# Altium project Driver_Display.PrjPcb
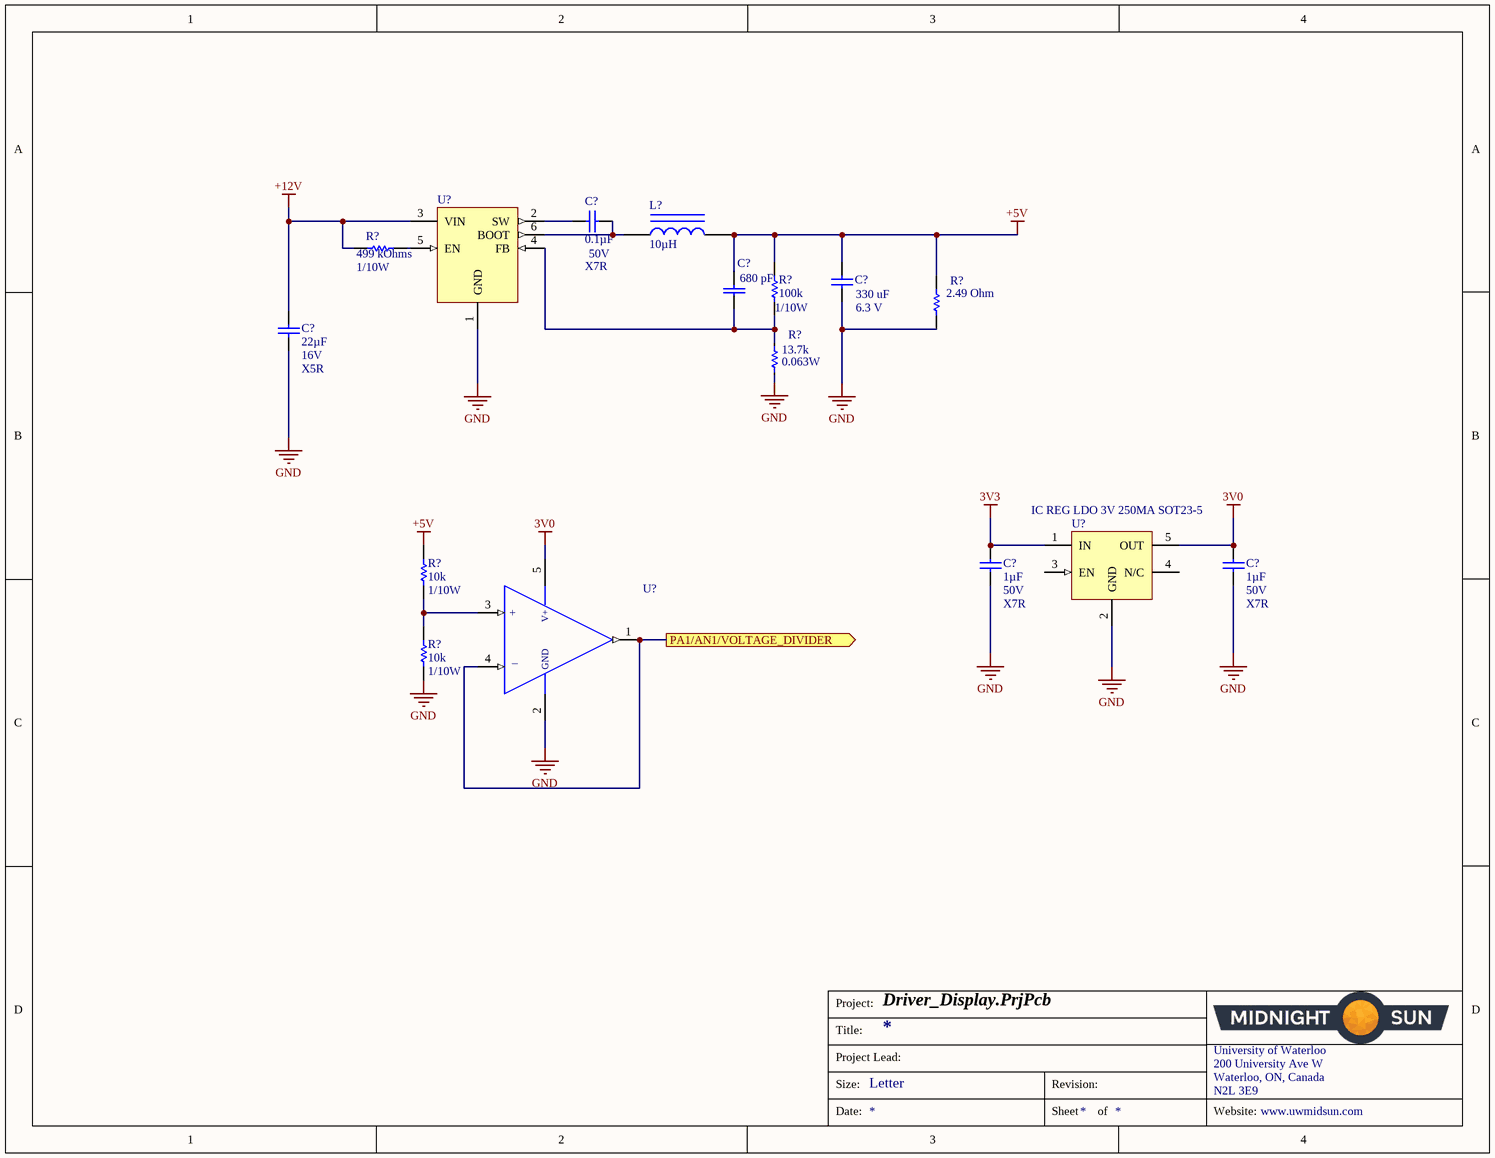
[diagram p0: Voltage Regulator.SchDoc]

5 sheets, 40 parts. Net scope: flat (ports and power ports of the same name join across sheets).
Board file: Driver_Display.PcbDoc
Sheets:
  Voltage Regulator.SchDoc
  RTC.SchDoc
  Ambient Light Sensor.SchDoc
  Controller_Board_Interface.SchDoc
  Connectors.SchDoc

## Sheet Voltage Regulator.SchDoc
size Letter; Organization: Midnight Sun Solar Rayce Car Team; Address1: University of Waterloo; Address2: 200 University Ave W; Address3: Waterloo, ON, Canada; Address4: N2L 3E9; Website: www.uwmidsun.com

### Parts
(Parts that share a designator on the sheet are numbered #1, #2 ... from top to bottom, then left to right.)
C?#1  Capacitance: 0.1µF  Voltage: 50V  Temperature Coefficient: X7R  [CAP, 0603]  (hidden comment: CAP CER 0.1UF 50V 10% X7R 0603)
C?#2  CAP CER 330UF 6.3V X5R 1210  (value not drawn)
C?#3  CAP CER 680PF 25V C0G 0201  [CAP, 0603]  (value not drawn)
C?#4  Capacitance: 22µF  Voltage: 16V  Temperature Coefficient: X5R  [CAP, 1210]  (hidden comment: CAP CER 22UF 16V ±20% X5R 1210)
C?#5  Capacitance: 1µF  Voltage: 50V  Temperature Coefficient: X7R  [CAP, 0603]  (hidden comment: CAP CER 1UF 50V 10% X7R 0603)
C?#6  Capacitance: 1µF  Voltage: 50V  Temperature Coefficient: X7R  [CAP, 0603]  (hidden comment: CAP CER 1UF 50V 10% X7R 0603)
L?  Inductance: 10µH  [1210]  (hidden comment: IND 10uH 0.9A 20% 1210)
R?#1  RES 499K OHM 1% 1/10W 0603  [RES, 0603]  (value not drawn)
R?#2  Resistance: 100k  Power: 1/10W  [RES, 0603]  (hidden comment: RES 100K OHM 5% 1/8W 0603_1)
R?#3  RES 2.49 OHM 1% 1/10W 0603  [RES, 0603]  (value not drawn)
R?#4  RES 13.7K OHM 1% 1/10W 0603  [RES, 0603]  (value not drawn)
R?#5  Resistance: 10k  Power: 1/10W  [RES, 0603]  (hidden comment: RES 10K OHM 1% 1/10W 0603)
R?#6  Resistance: 10k  Power: 1/10W  [RES, 0603]  (hidden comment: RES 10K OHM 1% 1/10W 0603)
U?#1  IC REG BUCK ADJ 2A SYNC 6SOT  [SOT23-6]  (value not drawn)
U?#2  IC REG LDO 3V 250MA SOT23-5  [SOT95P280X145-5N]
U?#3  IC OP AMP GEN PURPOSE RR 10MHZ SOT-23-5  [IC OP AMP GP RR 10MHZ SOT-23-5]  (value not drawn)

### Ports
PA1/AN1/VOLTAGE_DIVIDER (out)

### Nets
3V0: C?#6.1 U?#2.5(OUT) U?#3.5(VDD)
3V3: C?#5.1 U?#2.1(IN)
+5V: C?#2.1 C?#3.1 L?.2 R?#2.1 R?#3.1 R?#5.1
+12V: C?#4.1 R?#1.1 U?#1.3(VIN)
GND: C?#2.2 C?#4.2 C?#5.2 C?#6.2 R?#3.2 R?#4.?2 R?#6.2 U?#1.1(GND) U?#2.2(GND) U?#3.2(VSS)
PA1/AN1: U?#3.1(OUTPUT) U?#3.4(-IN) ; port PA1/AN1/VOLTAGE_DIVIDER
NetC?#1_1: C?#1.1 U?#1.2(SW)
NetC?#1_2: C?#1.2 L?.1 U?#1.6(BOOT)
NetC?#3_2: C?#3.2 R?#2.2 R?#4.?1 U?#1.4(FB)
NetR?#1_2: R?#1.2 U?#1.5(EN)
NetR?#5_2: R?#5.2 R?#6.1 U?#3.3(+IN)

Not connected (* = marked no-connect by the designer): U?#2 3(EN) 4(N/C)

### Notes on the sheet
- (near R?#1) 499 kOhms
- (near R?#1) 1/10W
- (near C?#2) 330 uF
- (near C?#2) 6.3 V
- Project:
- Title:
- Size:
- Project Lead:
- Letter
- Revision:
- University of Waterloo
- 200 University Ave W
- Waterloo, ON, Canada
- N2L 3E9
- Date:
- Sheet
- of
- Website:
- (in symbol CAP CER 680PF 25V C0G 0201) 680 pF
- (in symbol IC OP AMP GEN PURPOSE RR 10MHZ SOT-23-5) V+; +; GND; _
- (in symbol RES 2.49 OHM 1% 1/10W 0603) 2.49 Ohm
- (in symbol RES 13.7K OHM 1% 1/10W 0603) 13.7k; 0.063W

### Library data of the parts
C?#1 = CAP CER 0.1UF 50V 10% X7R 0603: 0.10µF ±10% 50V Ceramic Capacitor X7R 0603 (1608 Metric); Manufacturer 1: AVX Corporation; Manufacturer Part Number 1: 06035C104KAT2A; Supplier 1: Digi-Key; Supplier Part Number 1: 478-5052-1-ND; Packaging: Cut Tape (CT); Part Status: Active; Operating Temperature: -55°C ~ 125°C; Ratings: -; Mounting Type: Surface Mount, MLCC; Package / Case: 0603 (1608 Metric); Size / Dimension: 0.063" L x 0.032" W (1.60mm x 0.81mm); Height - Seated (Max): -; Thickness (Max): 0.035" (0.90mm); Lead Spacing: -; Lead Style: -; ComponentLink1URL: http://datasheets.avx.com/X7RDielectric.pdf; ComponentLink1Description: http://datasheets.avx.com/X7RDielectric.pdf; Tolerance: ±10%
C?#2 = CAP CER 330UF 6.3V X5R 1210: 330µF ±20% 6.3V Ceramic Capacitor X5R 1210 (3225 Metric); Manufacturer: Taiyo Yuden; Manufacturer Part Number: JMK325ABJ337MM-P; Supplier 1: Digi-Key; Stock 1: 1427; Pricing 1: 1=5.57, 10=4.492, 100=3.5039, 500=2.6055 (USD); Supplier Part Number 1: 587-5449-1-ND
C?#3 = CAP CER 680PF 25V C0G 0201: 680pF ±5% 25V Ceramic Capacitor C0G, NP0 0201 (0603 Metric); Manufacturer: Murata; Manufacturer Part Number: GRM0335C1E681JA01D; Supplier 1: Digi-Key; Stock 1: 66100; Pricing 1: 1=0.1, 10=0.017, 100=0.0078, 500=0.0056, 1000=0.0044, 2500=0.004, 5000=0.0037 (USD); Voltage Rating (DC): 25V; Dielectric: C0G; Tolerance: 5%; Capacitance: 680pF; Length: 600um; Width: 300um; Thickness: 300um; Supplier Part Number 1: 490-14330-1-ND
C?#4 = CAP CER 22UF 16V ±20% X5R 1210: 22µF ±20% 16V Ceramic Capacitor X5R 1210 (3225 Metric); Manufacturer 1: Murata Electronics North America; Manufacturer Part Number 1: GRM32ER61C226ME20L; Supplier 1: Digi-Key; Supplier Part Number 1: 490-1881-1-ND; Packaging: Cut Tape (CT); Part Status: Active; Operating Temperature: -55°C ~ 85°C; Ratings: -; Mounting Type: Surface Mount, MLCC; Package / Case: 1210 (3225 Metric); Size / Dimension: 0.126" L x 0.098" W (3.20mm x 2.50mm); Height - Seated (Max): -; Thickness (Max): 0.106" (2.70mm); Lead Spacing: -; Lead Style: -; ComponentLink1URL: http://www.murata.com/~/media/webrenewal/support/library/catalog/products/capacitor/mlcc/c02e.ashx; ComponentLink1Description: http://www.murata.com/~/media/webrenewal/support/library/catalog/products/capacitor/mlcc/c02e.ashx; Tolerance: ±20%
C?#5 C?#6 = CAP CER 1UF 50V 10% X7R 0603: 1µF ±10% 50V Ceramic Capacitor X7R 0603 (1608 Metric); Manufacturer 1: Taiyo Yuden; Manufacturer Part Number 1: UMK107AB7105KA-T; Supplier 1: Digi-Key; Supplier Part Number 1: 587-3247-1-ND; Packaging: Cut Tape (CT); Part Status: Active; Operating Temperature: -55°C ~ 125°C; Ratings: -; Mounting Type: Surface Mount, MLCC; Package / Case: 0603 (1608 Metric); Size / Dimension: 0.063" L x 0.031" W (1.60mm x 0.80mm); Height - Seated (Max): -; Thickness (Max): 0.037" (0.95mm); Lead Spacing: -; Lead Style: -; ComponentLink1URL: http://www.yuden.co.jp/productdata/catalog/en/mlcc_all_e.pdf; ComponentLink1Description: http://www.yuden.co.jp/productdata/catalog/en/mlcc_all_e.pdf; Tolerance: ±10%
L? = IND 10uH 0.9A 20% 1210: 10µH Shielded Wirewound Inductor 900mA 420 mOhm Max 1210 (3225 Metric); Manufacturer: Murata Electronics North America; Manufacturer Part Number: 1277AS-H-100M=P2; Current - Saturation: 1.25A; Supplier 1: Digi-Key; Supplier Part Number 1: 490-10589-1-ND; Type: Wirewound; Tolerance: ±20%; Current Rating: 0.9A; Shielding: Shielded; DC Resistance (DCR): 420 mOhm Max; Height - Seated (Max): 0.047" (1.20mm); ComponentLink1URL: http://www.toko.co.jp/products-murata/pdf/inductors/m_dfe322512c.pdf; ComponentLink1Description: datasheet
R?#1 = RES 499K OHM 1% 1/10W 0603: 499 kOhms ±1% 0.1W, 1/10W Chip Resistor 0603 (1608 Metric) Automotive AEC-Q200 Thick Film; Manufacturer: Stackpole Electronics; Manufacturer Part Number: RMCF0603FT499K; Resistance: 499kR; Power Rating: 100mW; Temperature Coefficient: 100ppm/°C; Supplier 1: Digi-Key; Stock 1: 5000; Mount: Surface Mount; Case/Package: 0603; Case Code (Metric): 1608; Case Code (Imperial): 0603; Contact Plating: Tin,Matte; Min Operating Temperature: -55°C; Max Operating Temperature: 155°C; Tolerance: 1%; Packaging: Tape and Reel; Composition: Thick Film; Number of Terminations: 2; Max Power Dissipation: 100mW; Length: 0.061inch; Height: 0.022inch; Width: 0.031inch; Radiation Hardening: No; Lead Free: Lead Free; ComponentLink1URL: https://www.seielect.com/Catalog/SEI-RMCF_RMCP.pdf; ComponentLink1Description: https://www.seielect.com/Catalog/SEI-RMCF_RMCP.pdf; ComponentLink2URL: http://components.arrow.com/part/dataview/40961429S7516275N1174; ComponentLink2Description: http://components.arrow.com/part/dataview/40961429S7516275N1174; ComponentLink3URL: http://www.seielect.com/Catalog/SEI-RMCF_RMCP.pdf; ComponentLink3Description: http://www.seielect.com/Catalog/SEI-RMCF_RMCP.pdf; Supplier Part Number 1: RMCF0603FT499K-ND
R?#2 = RES 100K OHM 5% 1/8W 0603_1: RES SMD 100K OHM 5% 1/10W 0603; Manufacturer 1: Yageo; Manufacturer Part Number 1: RC0603JR-07100KL; Temperature Coefficient: ±100ppm/°C; Supplier 1: Digi-Key; Supplier Part Number 1: 311-100KGRCT-ND; Packaging: Cut Tape (CT); Part Status: Active; Composition: Thick Film; Operating Temperature: -55°C ~ 155°C; Package / Case: 0603 (1608 Metric); Supplier Device Package: 0603; Size / Dimension: 0.063" L x 0.031" W (1.60mm x 0.80mm); Height - Seated (Max): 0.022" (0.55mm); Failure Rate: -; ComponentLink1URL: http://www.yageo.com/documents/recent/PYu-RC_Group_51_RoHS_L_7.pdf; ComponentLink1Description: http://www.yageo.com/documents/recent/PYu-RC_Group_51_RoHS_L_7.pdf; Tolerance: ±5%
R?#3 = RES 2.49 OHM 1% 1/10W 0603: 2.49 Ohms ±1% 0.1W, 1/10W Chip Resistor 0603 (1608 Metric) Moisture Resistant Thick Film; Manufacturer: Yageo; Manufacturer Part Number: RC0603FR-072R49L; Resistance: 2.49R; Temperature Coefficient: 200ppm/°C; Power Rating: 100mW; Voltage Rating: 50V; Working Voltage: 75V; Supplier 1: Digi-Key; Stock 1: 24600; Pricing 1: 1=0.1, 10=0.022, 100=0.0089, 1000=0.004, 2500=0.0035 (USD); Case/Package: 0603; Case Code (Metric): 1608; Case Code (Imperial): 0603; Contact Plating: Tin,Matte; Min Operating Temperature: -55°C; Max Operating Temperature: 155°C; Tolerance: 1%; Package Quantity: 1; Packaging: Tape and Reel; Composition: Thick Film; Number of Terminations: 2; Max Power Dissipation: 100mW; Termination: SMD/SMT; Voltage Rating (DC): 50V; Length: 0.063inch; Height: 0.022inch; Width: 0.031inch; Radiation Hardening: No; Lead Free: Lead Free; ComponentLink1URL: https://datasheet.ciiva.com/2456/pyu-r-int-thick-7-2456963.pdf; ComponentLink1Description: https://datasheet.ciiva.com/2456/pyu-r-int-thick-7-2456963.pdf; ComponentLink2URL: https://datasheet.ciiva.com/2456/pyu-r-int-thick-7-2456964.pdf; ComponentLink2Description: https://datasheet.ciiva.com/2456/pyu-r-int-thick-7-2456964.pdf; ComponentLink3URL: https://datasheet.ciiva.com/2456/pyu-r-int-thick-7-2456965.pdf; ComponentLink3Description: https://datasheet.ciiva.com/2456/pyu-r-int-thick-7-2456965.pdf; ComponentLink4URL: https://datasheet.ciiva.com/12575/rc0603-272842-12575883.pdf; ComponentLink4Description: https://datasheet.ciiva.com/12575/rc0603-272842-12575883.pdf; Supplier Part Number 1: 311-2.49HRCT-ND
R?#4 = RES 13.7K OHM 1% 1/10W 0603: 13.7 kOhms ±1% 0.1W, 1/10W Chip Resistor 0603 (1608 Metric) Automotive AEC-Q200 Thick Film; Supplier 1: Digi-Key
R?#5 R?#6 = RES 10K OHM 1% 1/10W 0603: RES SMD 10K OHM 1% 1/10W 0603; Manufacturer 1: Yageo; Manufacturer Part Number 1: RC0603FR-0710KL; Temperature Coefficient: ±100ppm/°C; Supplier 1: Digi-Key; Supplier Part Number 1: 311-10.0KHRCT-ND; Packaging: Cut Tape (CT); Part Status: Active; Composition: Thick Film; Operating Temperature: -55°C ~ 155°C; Package / Case: 0603 (1608 Metric); Supplier Device Package: 0603; Size / Dimension: 0.063" L x 0.031" W (1.60mm x 0.80mm); Height - Seated (Max): 0.022" (0.55mm); Failure Rate: -; ComponentLink1URL: http://www.yageo.com/documents/recent/PYu-RC_Group_51_RoHS_L_7.pdf; ComponentLink1Description: http://www.yageo.com/documents/recent/PYu-RC_Group_51_RoHS_L_7.pdf; Tolerance: ±1%
U?#1 = IC REG BUCK ADJ 2A SYNC 6SOT: Buck Switching Regulator IC Positive Adjustable 0.596V 1 Output 2A SOT-23-6 Thin, TSOT-23-6; Manufacturer: Texas Instruments; Manufacturer Part Number: TPS54202HDDCT; Min Input Voltage: 4.5V; Max Input Voltage: 28V; Number of Outputs: 1; Min Output Voltage: 600mV; Max Output Voltage: 26V; Switching Frequency: 500kHz; Quiescent Current: 40uA; Supplier 1: Digi-Key; Stock 1: 2574; Pricing 1: 1=2, 10=1.796, 100=1.4436 (USD); Case/Package: SOT-6; Number of Pins: 6; Min Operating Temperature: -40°C; Max Operating Temperature: 125°C; Output Current: 2A; Packaging: Cut Tape; Output Voltage: 26V; REACH SVHC: No SVHC; Lead Free: Lead Free; ComponentLink1URL: http://www.ti.com/lit/ds/symlink/tps54202h.pdf; ComponentLink1Description: http://www.ti.com/lit/ds/symlink/tps54202h.pdf; ComponentLink2URL: http://www.ti.com/general/docs/lit/getliterature.tsp?genericPartNumber=TPS54202H&amp;&amp;fileType=pdf; ComponentLink2Description: http://www.ti.com/general/docs/lit/getliterature.tsp?genericPartNumber=TPS54202H&amp;&amp;fileType=pdf; ComponentLink3URL: http://www.ti.com/general/docs/lit/getliterature.tsp?genericPartNumber=TPS54202H&&fileType=pdf; ComponentLink3Description: http://www.ti.com/general/docs/lit/getliterature.tsp?genericPartNumber=TPS54202H&&fileType=pdf; Supplier Part Number 1: 296-44497-1-ND
U?#2 = IC REG LDO 3V 250MA SOT23-5: Linear Voltage Regulator IC Positive Fixed 1 Output 3V 250mA SOT-23-5; Manufacturer: Texas Instruments; Manufacturer Part Number: LP5907QMFX-3.0Q1; Number of Outputs: 1; Min Input Voltage: 2.2V; Max Input Voltage: 5.5V; Dropout Voltage: 50mV; Quiescent Current: 425uA; Accuracy: 2%; Supplier 1: Digi-Key; Stock 1: 160397; Pricing 1: 1=0.65, 10=0.56, 100=0.4182, 500=0.3286, 1000=0.2539 (USD); Mount: Surface Mount; Min Operating Temperature: -40°C; Max Operating Temperature: 125°C; Max Output Current: 250mA; Output Voltage: 3V; Packaging: Tape and Reel; Output Current: 250mA; Number of Regulators: 1; Polarity: Positive; Radiation Hardening: No; Lead Free: Lead Free; ComponentLink1URL: https://datasheet.ciiva.com/48677/lp5907-q1-48677562.pdf; ComponentLink1Description: https://datasheet.ciiva.com/48677/lp5907-q1-48677562.pdf; Supplier Part Number 1: 296-40364-1-ND
U?#3 = IC OP AMP GEN PURPOSE RR 10MHZ SOT-23-5: General Purpose Amplifier 1 Circuit Rail-to-Rail SOT-23-5; Manufacturer 1: Texas Instruments; Manufacturer Part Number 1: TLV316QDBVRQ1; Description 1: IC OP AMP GP RR 10MHZ 5-SOT-23; Number of Circuits: 1; Slew Rate: 6 V/µs; Current - Supply: 400µA; Current - Output / Channel: 50mA; Voltage - Supply, Single/Dual (±): 1.8 V ~ 5.5 V, ±0.9 V ~ 2.75 V; Supplier 1: Digi-Key; Supplier Part Number 1: 296-45323-1-ND; RoHS: RoHS Compliant; Category: Integrated Circuits (ICs); Stock 1: 1747; Pricing 1: 1=1.33, 10=1.185, 100=0.9234, 500=0.76276, 1000=0.60218 (CAD); Packaging: Cut Tape (CT); Part Status: Active; Amplifier Type: General Purpose; Output Type: Rail-to-Rail; -3db Bandwidth: -; Operating Temperature: -40°C ~ 125°C; Mounting Type: Surface Mount; Package / Case: SC-74A, SOT-753; Supplier Device Package: SOT-23-5; ComponentLink1URL: http://www.ti.com/lit/ds/symlink/tlv316-q1.pdf; ComponentLink1Description: http://www.ti.com/lit/ds/symlink/tlv316-q1.pdf

## Sheet RTC.SchDoc
size Letter; Organization: Midnight Sun Solar Rayce Car Team; Address1: University of Waterloo; Address2: 200 University Ave W; Address3: Waterloo, ON, Canada; Address4: N2L 3E9; Website: www.uwmidsun.com
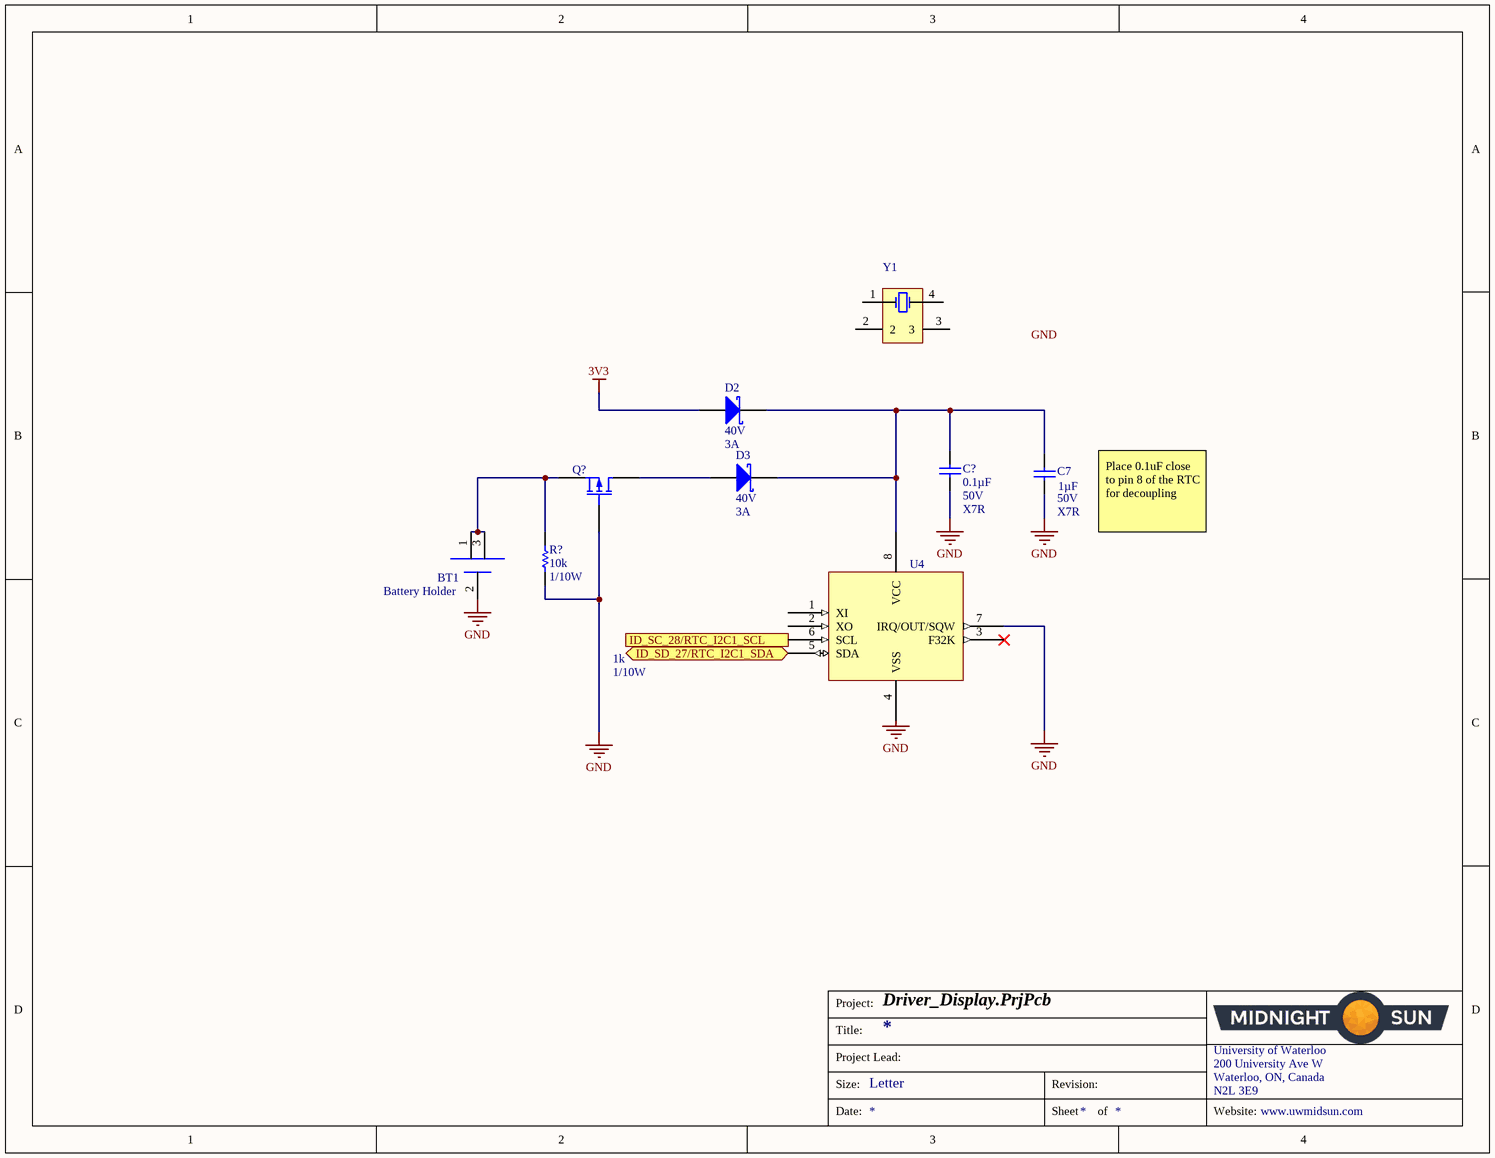
[diagram p1: RTC.SchDoc]

### Parts
(Parts that share a designator on the sheet are numbered #1, #2 ... from top to bottom, then left to right.)
BT1  HOLDER COIN CELL FOR CR1220 SMD  [HOLDER BUTTON BATTERY 3V]  (value not drawn)
C7  Capacitance: 1µF  Voltage: 50V  Temperature Coefficient: X7R  [CAP, 0603]  (hidden comment: CAP CER 1UF 50V 10% X7R 0603)
C?#7  Capacitance: 0.1µF  Voltage: 50V  Temperature Coefficient: X7R  [CAP, 0603]  (hidden comment: CAP CER 0.1UF 50V 10% X7R 0603)
D2  Voltage - DC Reverse (Vr) (Max): 40V  Current - Average Rectified (Io): 3A  [DO-214AA Diode]  (hidden comment: DIODE SCHOTTKY 40V 3A DO-214AA (SMB))
D3  Voltage - DC Reverse (Vr) (Max): 40V  Current - Average Rectified (Io): 3A  [DO-214AA Diode]  (hidden comment: DIODE SCHOTTKY 40V 3A DO-214AA (SMB))
Q?  MOSFET P-CH 16V 2.5A X2-DFN2015  [DFN86P197X40-3N]  (value not drawn)
R?#7  Resistance: 10k  Power: 1/10W  [RES, 0603]  (hidden comment: RES 10K OHM 1% 1/10W 0603)
U4  IC RTC CLK/CALENDAR I2C 8-SOIC  [SOIC8]  (value not drawn)
Y1  CRYSTAL 32.7680KHZ 12.5PF SMD  [4-SOJ]  (value not drawn)

### Ports
ID_SC_28/RTC_I2C1_SCL (in), ID_SD_27/RTC_I2C1_SDA (bidir)

### Nets
3V3: D2.1(A)
GND: BT1.2(negative) C7.2 C?#7.2 Q?.1(G) R?#7.2 U4.7(IRQ/OUT/SQW)
NetBT1_1: BT1.1(positive_1) BT1.3(positive_2) Q?.2(S) R?#7.1
NetC7_1: C7.1 C?#7.1 D2.2(K) D3.2(K) U4.8(VCC)
NetD3_1: D3.1(A) Q?.3(D)
NetU4_5: U4.5(SDA) ; port ID_SD_27/RTC_I2C1_SDA
NetU4_6: U4.6(SCL) ; port ID_SC_28/RTC_I2C1_SCL

Not connected (* = marked no-connect by the designer): U4 1(XI) 2(XO) 3(F32K)* 4(VSS); Y1 1 2 3 4

### Notes on the sheet
- Place 0.1uF close to pin 8 of the RTC for decoupling
- (near BT1) Battery Holder
- 1k
- 1/10W
- Project:
- Title:
- Size:
- Project Lead:
- Letter
- Revision:
- University of Waterloo
- 200 University Ave W
- Waterloo, ON, Canada
- N2L 3E9
- Date:
- Sheet
- of
- Website:
- Labels drawn without touching a wire or pin: GND

### Library data of the parts
BT1 = HOLDER COIN CELL FOR CR1220 SMD: Coin cell holder; Manufacturer: Memory Protection Devices; Manufacturer Part Number: BC501SM-TR; Number of Cells: 1; Body Material: Bronze; Supplier 1: Digi-Key; Stock 1: 21261; Pricing 1: 1=1.26, 10=1.166, 100=1.1029 (USD); Mount: Surface Mount,PCB; Case/Package: SMD/SMT; Min Operating Temperature: -40°C; Max Operating Temperature: 85°C; Package Quantity: 500; Termination: SMD/SMT; ComponentLink1URL: https://datasheet.ciiva.com/4/bc501sm-tr-datasheet-4384.pdf; ComponentLink1Description: https://datasheet.ciiva.com/4/bc501sm-tr-datasheet-4384.pdf; Supplier 2: Digi-Key; Stock 2: 19094; Pricing 2: 1=0.58, 10=0.545, 50=0.4356, 100=0.4175, 250=0.3812, 500=0.363, 1000=0.305, 2500=0.2723, 5000=0.2632 (USD); Contact Material: Bronze,Nickel; Material: Bronze; Contact Plating: Nickel; Packaging: Bulk; Number of Batteries: 1; Diameter: 12mm; Height: 3.17mm; REACH SVHC: No SVHC; Lead Free: Lead Free; ComponentLink2URL: https://datasheet.ciiva.com/3/3000-3953.pdf; ComponentLink2Description: https://datasheet.ciiva.com/3/3000-3953.pdf; ComponentLink3URL: https://datasheet.ciiva.com/11714/0900766b8002ef78-11714721.pdf; ComponentLink3Description: https://datasheet.ciiva.com/11714/0900766b8002ef78-11714721.pdf; ComponentLink4URL: https://datasheet.ciiva.com/20221/18-3570e-20221596.pdf; ComponentLink4Description: https://datasheet.ciiva.com/20221/18-3570e-20221596.pdf; ComponentLink5URL: https://datasheet.ciiva.com/1391/1718262-1391630.pdf; ComponentLink5Description: https://datasheet.ciiva.com/1391/1718262-1391630.pdf; Supplier Part Number 2: 36-3000-ND
C7 = CAP CER 1UF 50V 10% X7R 0603: as C?#5 on sheet Voltage Regulator; Supplier 1: Digi-Key; Supplier Part Number 1: 587-3247-1-ND; Packaging: Cut Tape (CT); Part Status: Active; Operating Temperature: -55°C ~ 125°C; Ratings: -; Mounting Type: Surface Mount, MLCC; Package / Case: 0603 (1608 Metric); Size / Dimension: 0.063" L x 0.031" W (1.60mm x 0.80mm); Height - Seated (Max): -; Thickness (Max): 0.037" (0.95mm); Lead Spacing: -; Lead Style: -; ComponentLink1URL: http://www.yuden.co.jp/productdata/catalog/en/mlcc_all_e.pdf; ComponentLink1Description: http://www.yuden.co.jp/productdata/catalog/en/mlcc_all_e.pdf; Tolerance: ±10%
C?#7 = CAP CER 0.1UF 50V 10% X7R 0603: as C?#1 on sheet Voltage Regulator; Supplier 1: Digi-Key; Supplier Part Number 1: 478-5052-1-ND; Packaging: Cut Tape (CT); Part Status: Active; Operating Temperature: -55°C ~ 125°C; Ratings: -; Mounting Type: Surface Mount, MLCC; Package / Case: 0603 (1608 Metric); Size / Dimension: 0.063" L x 0.032" W (1.60mm x 0.81mm); Height - Seated (Max): -; Thickness (Max): 0.035" (0.90mm); Lead Spacing: -; Lead Style: -; ComponentLink1URL: http://datasheets.avx.com/X7RDielectric.pdf; ComponentLink1Description: http://datasheets.avx.com/X7RDielectric.pdf; Tolerance: ±10%
D2 D3 = DIODE SCHOTTKY 40V 3A DO-214AA (SMB): Diode Schottky 40V 3A Surface Mount DO-214AA (SMB); Manufacturer 1: Comchip Technology; Manufacturer Part Number 1: CDBB340-HF; Voltage - Forward (Vf) (Max) @ If: 500mV @ 3A; Speed: Fast Recovery =< 500ns, > 200mA (Io); Current - Reverse Leakage @ Vr: 500µA @ 40V; Capacitance @ Vr, F: 250pF @ 4V, 1MHz; Supplier 1: Digi-Key; Supplier Part Number 1: 641-1722-1-ND; Packaging: Cut Tape (CT); Part Status: Active; Diode Type: Schottky; Mounting Type: Surface Mount; Package / Case: DO-214AA, SMB; Supplier Device Package: DO-214AA (SMB); Operating Temperature - Junction: -40°C ~ 70°C; ComponentLink1URL: http://www.comchiptech.com/cms/UserFiles/CDBB340-HF%20Thru849517.%20CDBB3100-HF%20RevE.pdf; ComponentLink1Description: http://www.comchiptech.com/cms/UserFiles/CDBB340-HF%20Thru849517.%20CDBB3100-HF%20RevE.pdf
Q? = MOSFET P-CH 16V 2.5A X2-DFN2015: P-Channel 16V 2.5A (Ta) 650mW (Ta) Surface Mount X2-DFN2015-3; Manufacturer 1: Diodes Incorporated; Manufacturer Part Number 1: DMG3415UFY4Q-7; Drive Voltage (Max Rds On,  Min Rds On): 1.8V, 4.5V; Vgs(th) (Max) @ Id: 1V @ 250µA; Gate Charge (Qg) (Max) @ Vgs: 10nC @ 4.5V; Input Capacitance (Ciss) (Max) @ Vds: 282pF @ 10V; Vgs (Max): ±8V; Rds On (Max) @ Id, Vgs: 39 mOhm @ 4A, 4.5V; Supplier 1: Digi-Key; Supplier Part Number 1: DMG3415UFY4Q-7DICT-ND; Packaging: Cut Tape (CT); Part Status: Active; FET Type: P-Channel; Technology: MOSFET (Metal Oxide); Drain to Source Voltage (Vdss): 16V; Current - Continuous Drain (Id) @ 25°C: 2.5A (Ta); FET Feature: -; Power Dissipation (Max): 650mW (Ta); Operating Temperature: -55°C ~ 150°C (TJ); Mounting Type: Surface Mount; Supplier Device Package: X2-DFN2015-3; Package / Case: 3-XFDFN; ComponentLink1URL: https://www.diodes.com/assets/Datasheets/DMG3415UFY4Q.pdf; ComponentLink1Description: https://www.diodes.com/assets/Datasheets/DMG3415UFY4Q.pdf
R?#7 = RES 10K OHM 1% 1/10W 0603: as R?#5 on sheet Voltage Regulator; Supplier 1: Digi-Key; Supplier Part Number 1: 311-10.0KHRCT-ND; Packaging: Cut Tape (CT); Part Status: Active; Composition: Thick Film; Operating Temperature: -55°C ~ 155°C; Package / Case: 0603 (1608 Metric); Supplier Device Package: 0603; Size / Dimension: 0.063" L x 0.031" W (1.60mm x 0.80mm); Height - Seated (Max): 0.022" (0.55mm); Failure Rate: -; ComponentLink1URL: http://www.yageo.com/documents/recent/PYu-RC_Group_51_RoHS_L_7.pdf; ComponentLink1Description: http://www.yageo.com/documents/recent/PYu-RC_Group_51_RoHS_L_7.pdf; Tolerance: ±1%
U4 = IC RTC CLK/CALENDAR I2C 8-SOIC: Real Time Clock (RTC) IC Clock/Calendar I²C, 2-Wire Serial 8-SOIC (0.154", 3.90mm Width); Manufacturer: STMicroelectronics; Manufacturer Part Number: M41T80M6F; Non-volatile Memory Size: 20B; Max Supply Voltage: 5.5V; Min Supply Voltage: 2V; Interface: I2C,Serial,2-Wire; Time Format: HH:MM:SS:hh (24 hr); Date Format: YY-MM-DD-dd; Supplier 1: Digi-Key; Stock 1: 1177; Pricing 1: 1=2.24, 10=2.012, 100=1.6169, 500=1.3284, 1000=1.1007 (USD); Mount: Surface Mount; Case/Package: SOIC; Number of Pins: 8; Weight: 0.019048oz; Contact Plating: Tin,Matte; Min Operating Temperature: -40°C; Max Operating Temperature: 85°C; Packaging: Tape and Reel; Package Quantity: 2500; Logic Function: Clock; Memory Size: 20B; RAM Size: 20B; Radiation Hardening: No; Lead Free: Lead Free; ComponentLink1URL: https://datasheet.ciiva.com/4772/cd00003119-4772151.pdf; ComponentLink1Description: https://datasheet.ciiva.com/4772/cd00003119-4772151.pdf; ComponentLink2URL: https://datasheet.ciiva.com/8145/cd00003119-8145447.pdf; ComponentLink2Description: https://datasheet.ciiva.com/8145/cd00003119-8145447.pdf; ComponentLink3URL: https://datasheet.ciiva.com/26795/m41t80m6f-26795475.pdf; ComponentLink3Description: https://datasheet.ciiva.com/26795/m41t80m6f-26795475.pdf; ComponentLink4URL: https://datasheet.ciiva.com/41459/001185350-da-01-en-ic-rtc-serial-w-ala-m41t80m6f-soic-8-stm-41459822.pdf; ComponentLink4Description: https://datasheet.ciiva.com/41459/001185350-da-01-en-ic-rtc-serial-w-ala-m41t80m6f-soic-8-stm-41459822.pdf; Supplier Part Number 1: 497-4708-1-ND
Y1 = CRYSTAL 32.7680KHZ 12.5PF SMD: 32.768kHz ±20ppm Crystal 12.5pF 50 kOhms 4-SOJ, 5.50mm pitch; Manufacturer: ECS International; Manufacturer Part Number: ECS-.327-12.5-17X-TR; ESR (Equivalent Series Resistance): 50kR; Supplier 1: Digi-Key; Stock 1: 67622; Pricing 1: 1=0.56, 10=0.468, 50=0.4208, 100=0.374, 500=0.3553, 1000=0.2992 (USD); Mount: Surface Mount; Min Operating Temperature: -40°C; Max Operating Temperature: 85°C; Package Quantity: 1; Frequency: 32.768kHz; Frequency Tolerance: 20ppm; Load Capacitance: 12.5pF; Packaging: Tape and Reel; Tolerance: 20ppm; Termination: SMD/SMT; Length: 0.315inch; Height: 0.098inch; Width: 0.15inch; Lead Free: Lead Free; ComponentLink1URL: https://datasheet.ciiva.com/852/ecx-306x-852775.pdf; ComponentLink1Description: https://datasheet.ciiva.com/852/ecx-306x-852775.pdf; ComponentLink2URL: https://datasheet.ciiva.com/852/ecx-306x-852776.pdf; ComponentLink2Description: https://datasheet.ciiva.com/852/ecx-306x-852776.pdf; ComponentLink3URL: https://datasheet.ciiva.com/852/ecx-306x-852777.pdf; ComponentLink3Description: https://datasheet.ciiva.com/852/ecx-306x-852777.pdf; Supplier Part Number 1: XC1195CT-ND

## Sheet Ambient Light Sensor.SchDoc
size Letter; Organization: Midnight Sun Solar Rayce Car Team; Address1: University of Waterloo; Address2: 200 University Ave W; Address3: Waterloo, ON, Canada; Address4: N2L 3E9; Website: www.uwmidsun.com
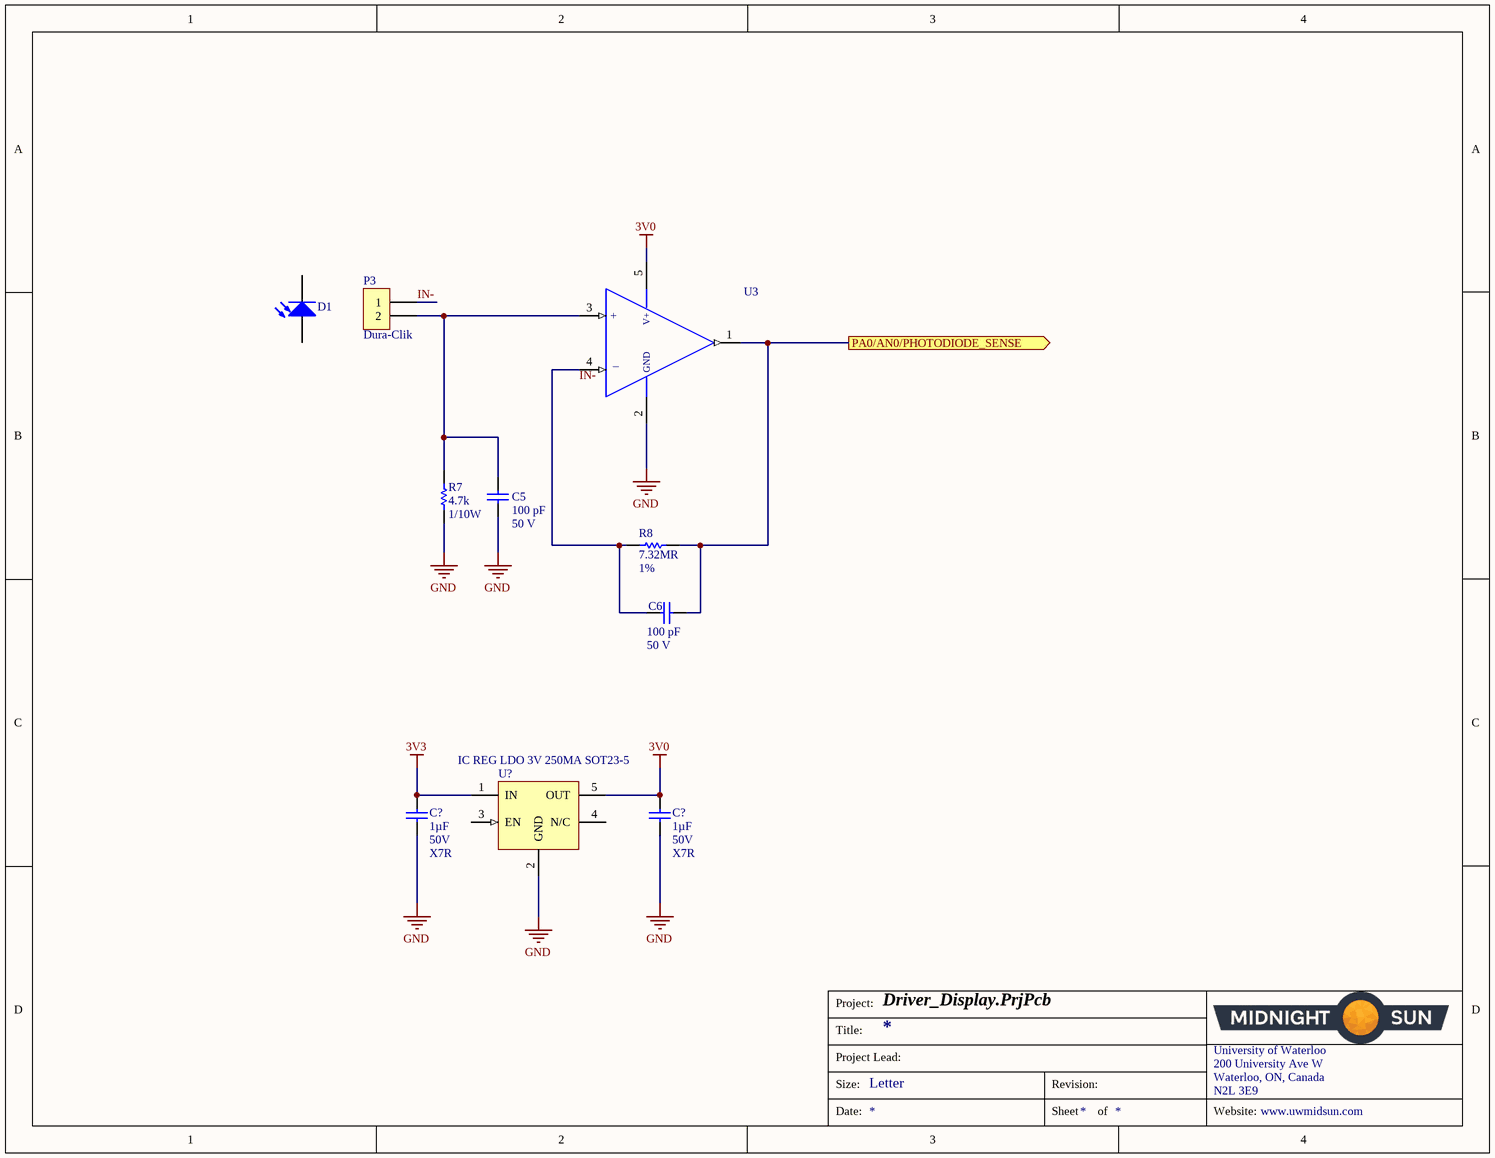
[diagram p2: Ambient Light Sensor.SchDoc]

### Parts
(Parts that share a designator on the sheet are numbered #1, #2 ... from top to bottom, then left to right.)
C5  CAP CER 100PF 50V C0G/NP0 0603  [CAP, 0603]  (value not drawn)
C6  CAP CER 100PF 50V C0G/NP0 0603  [CAP, 0603]  (value not drawn)
C?#8  Capacitance: 1µF  Voltage: 50V  Temperature Coefficient: X7R  [CAP, 0603]  (hidden comment: CAP CER 1UF 50V 10% X7R 0603)
C?#9  Capacitance: 1µF  Voltage: 50V  Temperature Coefficient: X7R  [CAP, 0603]  (hidden comment: CAP CER 1UF 50V 10% X7R 0603)
D1  DIODE 880NM W/FLTR THRUHOLE  (value not drawn)  (graphical)
P3  Dura-Clik  [CONN, 2POS Dura-Click Vertical]
R7  Resistance (Ohms): 4.7k  Power (Watts): 1/10W  [RES, 0603]  (hidden comment: RES 4.7K OHM 1% 1/10W 0603)
R8  Resistance: 7.32MR  Tolerance: 1%  [RES, 0603]  (hidden comment: RES 7.32M OHM 1% 1/10W 0603)
U3  IC OP AMP GEN PURPOSE RR 10MHZ SOT-23-5  [IC OP AMP GP RR 10MHZ SOT-23-5]  (value not drawn)
U?#4  IC REG LDO 3V 250MA SOT23-5  [SOT95P280X145-5N]

### Ports
PA0/AN0/PHOTODIODE_SENSE (out)

### Nets
3V0: C?#9.1 U3.5(VDD) U?#4.5(OUT)
3V3: C?#8.1 U?#4.1(IN)
GND: C5.2 C?#8.2 C?#9.2 R7.1 U3.2(VSS) U?#4.2(GND)
IN-: P3.1
PA0/AN0: C6.2 R8.1 U3.1(OUTPUT) ; port PA0/AN0/PHOTODIODE_SENSE
NetC5_1: C5.1 P3.2 R7.2 U3.3(+IN)
NetC6_1: C6.1 R8.1 U3.4(-IN)

Not connected (* = marked no-connect by the designer): D1 1(A) 2(K); U?#4 3(EN) 4(N/C)

### Notes on the sheet
- (near C5) 100 pF
- (near C5) 50 V
- (near C6) 100 pF
- (near C6) 50 V
- Project:
- Title:
- Size:
- Project Lead:
- Letter
- Revision:
- University of Waterloo
- 200 University Ave W
- Waterloo, ON, Canada
- N2L 3E9
- Date:
- Sheet
- of
- Website:
- Labels drawn without touching a wire or pin: IN-
- (in symbol IC OP AMP GEN PURPOSE RR 10MHZ SOT-23-5) V+; +; GND; _

### Library data of the parts
C5 C6 = CAP CER 100PF 50V C0G/NP0 0603: 100pF ±1% 50V Ceramic Capacitor C0G, NP0 0603 (1608 Metric); Manufacturer: Kyocera AVX; Manufacturer Part Number: 06035A101FAT2A; Supplier 1: Digi-Key; Stock 1: 176069; Pricing 1: 1=0.24, 10=0.161, 100=0.0814, 500=0.0557, 1000=0.0493 (USD); Mount: Surface Mount; Case/Package: 0603; Case Code (Imperial): 0603; Case Code (Metric): 1608; Min Operating Temperature: -55°C; Max Operating Temperature: 125°C; Capacitance: 100pF; Tolerance: 1%; Packaging: Tape and Reel; Voltage Rating: 50V; Package Quantity: 1; Voltage Rating (DC): 50V; Dielectric: C0G; Termination: SMD/SMT; Voltage: 50V; Length: 1.6mm; Height: 0.86mm; Width: 0.81mm; Thickness: 0.035inch; Depth: 0.81mm; Radiation Hardening: No; REACH SVHC: No SVHC; Lead Free: Lead Free; ComponentLink1URL: https://datasheet.ciiva.com/22682/1796416-22682854.pdf; ComponentLink1Description: https://datasheet.ciiva.com/22682/1796416-22682854.pdf; ComponentLink2URL: https://datasheet.ciiva.com/150/ccog-150746.pdf; ComponentLink2Description: https://datasheet.ciiva.com/150/ccog-150746.pdf; ComponentLink3URL: https://datasheet.ciiva.com/150/ccog-150747.pdf; ComponentLink3Description: https://datasheet.ciiva.com/150/ccog-150747.pdf; ComponentLink4URL: https://datasheet.ciiva.com/150/ccog-150748.pdf; ComponentLink4Description: https://datasheet.ciiva.com/150/ccog-150748.pdf; ComponentLink5URL: https://datasheet.ciiva.com/28585/1796416-28585980.pdf; ComponentLink5Description: https://datasheet.ciiva.com/28585/1796416-28585980.pdf; ComponentLink6URL: https://datasheet.ciiva.com/16300/ccog-16300413.pdf; ComponentLink6Description: https://datasheet.ciiva.com/16300/ccog-16300413.pdf; ComponentLink7URL: https://datasheet.ciiva.com/17492/ccog-17492189.pdf; ComponentLink7Description: https://datasheet.ciiva.com/17492/ccog-17492189.pdf; Supplier Part Number 1: 478-6202-1-ND
C?#8 C?#9 = CAP CER 1UF 50V 10% X7R 0603: as C?#5 on sheet Voltage Regulator; Supplier 1: Digi-Key; Supplier Part Number 1: 587-3247-1-ND; Packaging: Cut Tape (CT); Part Status: Active; Operating Temperature: -55°C ~ 125°C; Ratings: -; Mounting Type: Surface Mount, MLCC; Package / Case: 0603 (1608 Metric); Size / Dimension: 0.063" L x 0.031" W (1.60mm x 0.80mm); Height - Seated (Max): -; Thickness (Max): 0.037" (0.95mm); Lead Spacing: -; Lead Style: -; ComponentLink1URL: http://www.yuden.co.jp/productdata/catalog/en/mlcc_all_e.pdf; ComponentLink1Description: http://www.yuden.co.jp/productdata/catalog/en/mlcc_all_e.pdf; Tolerance: ±10%
D1 = DIODE 880NM W/FLTR THRUHOLE: Photodiode 880nm 20ns 120° 2-DIP (0.213", 5.40mm); Manufacturer: Osram Opto; Manufacturer Part Number: BPW34FA; Forward Current: 100mA; Reverse Breakdown Voltage: 32V; Forward Voltage: 1.3V; Max Power Dissipation: 150mW; Polarity: Reverse; Dark Current: 2nA; Diode Type: PIN; Max Reverse Voltage (DC): 16V; Supplier 1: Digi-Key; Stock 1: 7675; Pricing 1: 1=1.12, 10=0.867, 25=0.7188, 100=0.6195, 250=0.5452, 500=0.4708, 1000=0.3717, 2500=0.3469, 5000=0.3345 (USD); Mount: Through Hole,PCB; Case/Package: DIP; Number of Pins: 2; Contact Plating: Tin,Matte; Min Operating Temperature: -40°C; Max Operating Temperature: 100°C; Package Quantity: 1000; Wavelength: 880nm; Viewing Angle: 120°; Rise Time: 20ns; Packaging: Bulk; Fall Time: 20ns; Response Time: 20ns; Power Dissipation: 150mW; Reverse Voltage (DC): 16V; Length: 4.5mm; Height: 2.2mm; Width: 4mm; Radiation Hardening: No; REACH SVHC: No SVHC; ComponentLink1URL: https://datasheet.ciiva.com/1248/1672033-1248688.pdf; ComponentLink1Description: https://datasheet.ciiva.com/1248/1672033-1248688.pdf; ComponentLink2URL: https://datasheet.ciiva.com/4697/pw34fa-pb-free-2007-03-30-21826-4697664.pdf; ComponentLink2Description: https://datasheet.ciiva.com/4697/pw34fa-pb-free-2007-03-30-21826-4697664.pdf; ComponentLink3URL: https://datasheet.ciiva.com/1248/23915-1248689.pdf; ComponentLink3Description: https://datasheet.ciiva.com/1248/23915-1248689.pdf; ComponentLink4URL: https://datasheet.ciiva.com/4269/bpw34faleadpbfreeproduct-rohscompliant-4269826.pdf; ComponentLink4Description: https://datasheet.ciiva.com/4269/bpw34faleadpbfreeproduct-rohscompliant-4269826.pdf; ComponentLink5URL: https://datasheet.ciiva.com/15223/getdatasheetpartid-103433-15223260.pdf; ComponentLink5Description: https://datasheet.ciiva.com/15223/getdatasheetpartid-103433-15223260.pdf; ComponentLink6URL: https://datasheet.ciiva.com/2819/00100764-0-2819838.pdf; ComponentLink6Description: https://datasheet.ciiva.com/2819/00100764-0-2819838.pdf; Supplier Part Number 1: 475-1072-ND
P3 = CONN 2POS DURA-CLIK 0.079" VERT: 2 Positions Header, Shrouded Connector 0.079" (2.00mm) Surface Mount, Vertical Tin; Manufacturer: Molex, LLC; Manufacturer Part Number: 5600200220; Style: Board to Cable/Wire; Shrouding: Shrouded - 4 Wall; Number of Positions: 2; Number of Positions Loaded: All; Mated Stacking Heights: 9.3mm; Supplier 1: Digi-Key; RoHS: RoHS Compliant; Category: Connectors, Interconnects; Stock 1: 11912; Pricing 1: 1=1.16, 10=1.012, 25=0.952, 50=0.9122, 100=0.8727, 250=0.79336 (CAD); Packaging: Cut Tape (CT); Part Status: Active; Connector Type: Header; Contact Type: Male Pin; Pitch - Mating: 0.079" (2.00mm); Number of Rows: 1; Row Spacing - Mating: -; Mounting Type: Surface Mount; Termination: Solder; Fastening Type: Latch Lock; Contact Length - Mating: -; Contact Length - Post: -; Overall Contact Length: -; Insulation Height: 0.315" (8.00mm); Contact Shape: Square; Contact Finish - Mating: Tin; Contact Finish Thickness - Mating: -; Contact Finish - Post: Tin; Contact Material: Copper Alloy; Insulation Material: Polyamide (PA), Nylon; Features: Solder Retention; Operating Temperature: -; Ingress Protection: -; Material Flammability Rating: -; Insulation Color: Natural; Current Rating: -; Voltage Rating: -; Contact Finish Thickness - Post: -; Applications: Automotive, Industrial; ComponentLink1URL: http://www.molex.com/pdm_docs/sd/5600200220_sd.pdf; ComponentLink1Description: http://www.molex.com/pdm_docs/sd/5600200220_sd.pdf; Supplier Part Number 1: WM10862CT-ND
R7 = RES 4.7K OHM 1% 1/10W 0603: 4.7k Ohm ±1% 0.1W, 1/10W Chip Resistor 0603 (1608 Metric) Moisture Resistant Thick Film; Manufacturer 1: Yageo; Manufacturer Part Number 1: RC0603FR-074K7L; Description 1: RES SMD 4.7K OHM 1% 1/10W 0603; Temperature Coefficient: ±100ppm/°C; Supplier 1: Digi-Key; Supplier Part Number 1: 311-4.70KHRCT-ND; RoHS: RoHS Compliant; Category: Resistors; Stock 1: 3487566; Pricing 1: 1=0.16, 10=0.022, 100=0.0089, 1000=0.00402, 2500=0.00349 (CAD); Packaging: Cut Tape (CT); Part Status: Active; Composition: Thick Film; Features: Moisture Resistant; Operating Temperature: -55°C ~ 155°C; Package / Case: 0603 (1608 Metric); Supplier Device Package: 0603; Size / Dimension: 0.063" L x 0.031" W (1.60mm x 0.80mm); Height - Seated (Max): 0.022" (0.55mm); Failure Rate: -; ComponentLink1URL: http://www.yageo.com/documents/recent/PYu-RC_Group_51_RoHS_L_7.pdf; ComponentLink1Description: http://www.yageo.com/documents/recent/PYu-RC_Group_51_RoHS_L_7.pdf; Tolerance: ±1%
R8 = RES 7.32M OHM 1% 1/10W 0603: 7.32 MOhms ±1% 0.1W, 1/10W Chip Resistor 0603 (1608 Metric) Automotive AEC-Q200 Thick Film; Manufacturer: Stackpole Electronics; Manufacturer Part Number: RMCF0603FT7M32; Temperature Coefficient: 200ppm/°C; Supplier 1: Digi-Key; Stock 1: 4815; Pricing 1: 1=0.1, 10=0.016, 100=0.0064, 1000=0.0029, 2500=0.0025 (USD); Mount: Surface Mount; Case/Package: 0603; Contact Plating: Tin,Matte; Min Operating Temperature: -55°C; Max Operating Temperature: 155°C; Packaging: Tape and Reel; Composition: Thick Film; Radiation Hardening: No; ComponentLink1URL: https://www.seielect.com/catalog/SEI-RMCF_RMCP.pdf; ComponentLink1Description: https://www.seielect.com/catalog/SEI-RMCF_RMCP.pdf; Supplier Part Number 1: RMCF0603FT7M32CT-ND
U3 = IC OP AMP GEN PURPOSE RR 10MHZ SOT-23-5: as U?#3 on sheet Voltage Regulator; Supplier 1: Digi-Key; Supplier Part Number 1: 296-45323-1-ND; RoHS: RoHS Compliant; Category: Integrated Circuits (ICs); Stock 1: 1747; Pricing 1: 1=1.33, 10=1.185, 100=0.9234, 500=0.76276, 1000=0.60218 (CAD); Packaging: Cut Tape (CT); Part Status: Active; Amplifier Type: General Purpose; Output Type: Rail-to-Rail; -3db Bandwidth: -; Operating Temperature: -40°C ~ 125°C; Mounting Type: Surface Mount; Package / Case: SC-74A, SOT-753; Supplier Device Package: SOT-23-5; ComponentLink1URL: http://www.ti.com/lit/ds/symlink/tlv316-q1.pdf; ComponentLink1Description: http://www.ti.com/lit/ds/symlink/tlv316-q1.pdf
U?#4 = IC REG LDO 3V 250MA SOT23-5: as U?#2 on sheet Voltage Regulator; Supplier 1: Digi-Key; Stock 1: 160397; Pricing 1: 1=0.65, 10=0.56, 100=0.4182, 500=0.3286, 1000=0.2539 (USD); Mount: Surface Mount; Min Operating Temperature: -40°C; Max Operating Temperature: 125°C; Max Output Current: 250mA; Output Voltage: 3V; Packaging: Tape and Reel; Output Current: 250mA; Number of Regulators: 1; Polarity: Positive; Radiation Hardening: No; Lead Free: Lead Free; ComponentLink1URL: https://datasheet.ciiva.com/48677/lp5907-q1-48677562.pdf; ComponentLink1Description: https://datasheet.ciiva.com/48677/lp5907-q1-48677562.pdf; Supplier Part Number 1: 296-40364-1-ND

## Sheet Controller_Board_Interface.SchDoc
size Letter; Website: www.uwmidsun.com
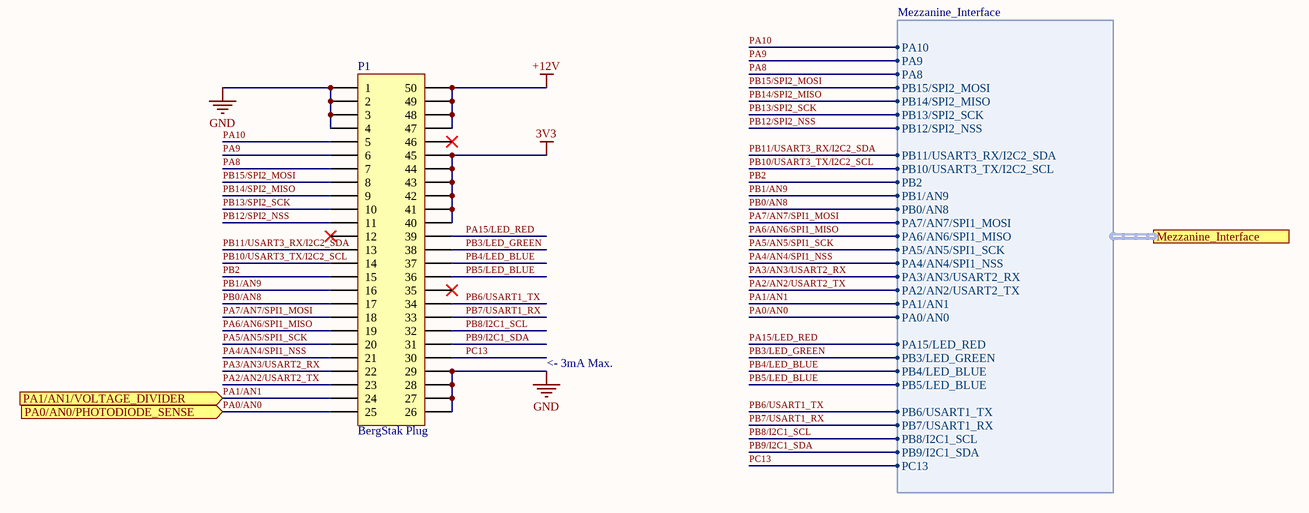
[diagram p3: Controller_Board_Interface.SchDoc]

### Parts
P1  Series: BergStak Plug  [CONN, Bergstak 50 Pos Plug]  (hidden comment: CONN 50POS Bergstak Plug 0.02")

### Ports
Mezzanine_Interface (harness Mezzanine_Interface), PA0/AN0/PHOTODIODE_SENSE (in), PA1/AN1/VOLTAGE_DIVIDER (in)

### Harnesses
Mezzanine_Interface: PA10, PA9, PA8, PB15/SPI2_MOSI, PB14/SPI2_MISO, PB13/SPI2_SCK, PB12/SPI2_NSS, PB11/USART3_RX/I2C2_SDA, PB10/USART3_TX/I2C2_SCL, PB2, PB1/AN9, PB0/AN8, PA7/AN7/SPI1_MOSI, PA6/AN6/SPI1_MISO, PA5/AN5/SPI1_SCK, PA4/AN4/SPI1_NSS, PA3/AN3/USART2_RX, PA2/AN2/USART2_TX, PA1/AN1, PA0/AN0, PA15/LED_RED, PB3/LED_GREEN, PB4/LED_BLUE, PB5/LED_BLUE, PB6/USART1_TX, PB7/USART1_RX, PB8/I2C1_SCL, PB9/I2C1_SDA, PC13

### Nets
3V3: P1.40 P1.41 P1.42 P1.43 P1.44 P1.45
+12V: P1.47 P1.48 P1.49 P1.50
GND: P1.1 P1.2 P1.3 P1.4 P1.26 P1.27 P1.28 P1.29
PA0/AN0: P1.25 ; port PA0/AN0/PHOTODIODE_SENSE, port Mezzanine_Interface.PA0/AN0
PA1/AN1: P1.24 ; port PA1/AN1/VOLTAGE_DIVIDER, port Mezzanine_Interface.PA1/AN1
PA2/AN2/USART2_TX: P1.23 ; port Mezzanine_Interface.PA2/AN2/USART2_TX
PA3/AN3/USART2_RX: P1.22 ; port Mezzanine_Interface.PA3/AN3/USART2_RX
PA4/AN4/SPI1_NSS: P1.21 ; port Mezzanine_Interface.PA4/AN4/SPI1_NSS
PA5/AN5/SPI1_SCK: P1.20 ; port Mezzanine_Interface.PA5/AN5/SPI1_SCK
PA6/AN6/SPI1_MISO: P1.19 ; port Mezzanine_Interface.PA6/AN6/SPI1_MISO
PA7/AN7/SPI1_MOSI: P1.18 ; port Mezzanine_Interface.PA7/AN7/SPI1_MOSI
PA8: P1.7 ; port Mezzanine_Interface.PA8
PA9: P1.6 ; port Mezzanine_Interface.PA9
PA10: P1.5 ; port Mezzanine_Interface.PA10
PA15/LED_RED: P1.39 ; port Mezzanine_Interface.PA15/LED_RED
PB0/AN8: P1.17 ; port Mezzanine_Interface.PB0/AN8
PB1/AN9: P1.16 ; port Mezzanine_Interface.PB1/AN9
PB2: P1.15 ; port Mezzanine_Interface.PB2
PB3/LED_GREEN: P1.38 ; port Mezzanine_Interface.PB3/LED_GREEN
PB4/LED_BLUE: P1.37 ; port Mezzanine_Interface.PB4/LED_BLUE
PB5/LED_BLUE: P1.36 ; port Mezzanine_Interface.PB5/LED_BLUE
PB6/USART1_TX: P1.34 ; port Mezzanine_Interface.PB6/USART1_TX
PB7/USART1_RX: P1.33 ; port Mezzanine_Interface.PB7/USART1_RX
PB8/I2C1_SCL: P1.32 ; port Mezzanine_Interface.PB8/I2C1_SCL
PB9/I2C1_SDA: P1.31 ; port Mezzanine_Interface.PB9/I2C1_SDA
PB10/USART3_TX/I2C2_SCL: P1.14 ; port Mezzanine_Interface.PB10/USART3_TX/I2C2_SCL
PB11/USART3_RX/I2C2_SDA: P1.13 ; port Mezzanine_Interface.PB11/USART3_RX/I2C2_SDA
PB12/SPI2_NSS: P1.11 ; port Mezzanine_Interface.PB12/SPI2_NSS
PB13/SPI2_SCK: P1.10 ; port Mezzanine_Interface.PB13/SPI2_SCK
PB14/SPI2_MISO: P1.9 ; port Mezzanine_Interface.PB14/SPI2_MISO
PB15/SPI2_MOSI: P1.8 ; port Mezzanine_Interface.PB15/SPI2_MOSI
PC13: P1.30 ; port Mezzanine_Interface.PC13

Not connected (* = marked no-connect by the designer): P1 12* 35* 46*

### Notes on the sheet
- <- 3mA Max.
- Project:
- Title:
- Size:
- Project Lead:
- Letter
- Revision:
- University of Waterloo
- 200 University Ave W
- Waterloo, ON, Canada
- N2L 3E9
- Date:
- Sheet
- of
- Website:

### Library data of the parts
P1 = CONN 50POS Bergstak Plug 0.02": 50 Position Connector Plug, Outer Shroud Contacts Surface Mount Gold; Manufacturer 1: Amphenol FCI; Manufacturer Part Number 1: 10132797-055100LF; Number of Positions: 50; Mated Stacking Heights: 5mm; Pitch: 0.020" (0.50mm); Supplier 1: Digi-Key; Supplier Part Number 1: 609-5226-1-ND; Packaging: Cut Tape (CT); Part Status: Active; Connector Type: Plug, Outer Shroud Contacts; Number of Rows: 2; Mounting Type: Surface Mount; Contact Finish: Gold; Contact Finish Thickness: 1µin (0.025µm); Height Above Board: 0.169" (4.30mm); ComponentLink1URL: http://portal.fciconnect.com/Comergent//fci/drawing/10132797.pdf; ComponentLink1Description: http://portal.fciconnect.com/Comergent//fci/drawing/10132797.pdf

## Sheet Connectors.SchDoc
size A4
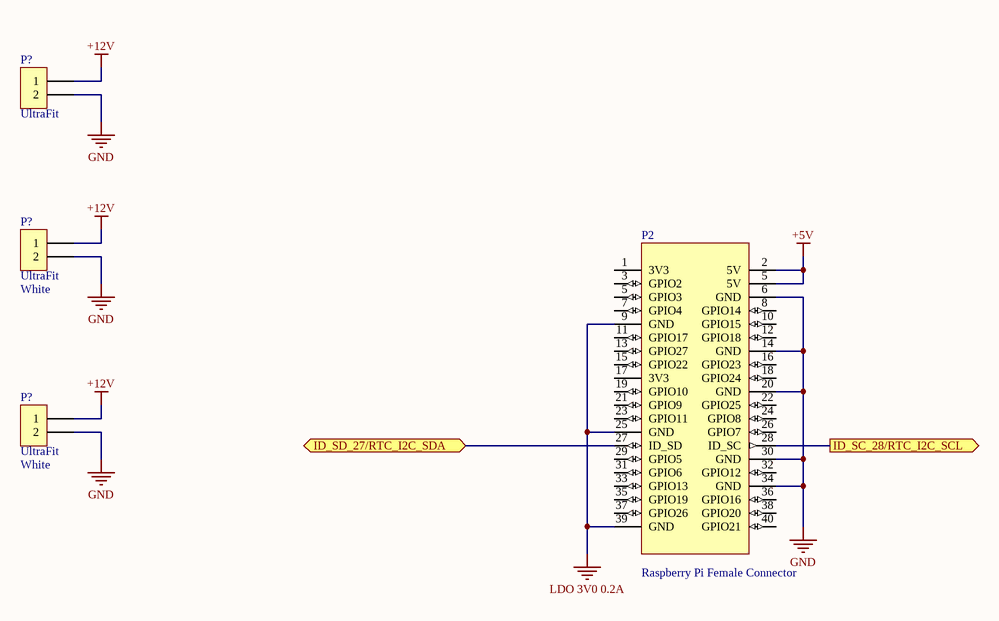
[diagram p4: Connectors.SchDoc]

### Parts
(Parts that share a designator on the sheet are numbered #1, #2 ... from top to bottom, then left to right.)
P2  CONN 40POS  [CONN 40-POS]  (value not drawn)
P?#1  Series: UltraFit  [CONN, 2POS ULTRA-FIT]  (hidden comment: CONN 2POS ULTRA-FIT 0.138")
P?#2  Series: UltraFit  Color: White  [CONN, 2POS ULTRA-FIT - NATURAL COLOR]  (hidden comment: CONN 2POS ULTRA-FIT NATURAL COLOR 0.138")
P?#3  Series: UltraFit  Color: White  [CONN, 2POS ULTRA-FIT - NATURAL COLOR]  (hidden comment: CONN 2POS ULTRA-FIT NATURAL COLOR 0.138")

### Ports
ID_SC_28/RTC_I2C_SCL (out), ID_SD_27/RTC_I2C_SDA (bidir)

### Nets
+5V: P2.2(5V) P2.5(GPIO3)
+12V: P?#1.1 P?#2.1 P?#3.1
GND: P2.6(GND) P2.14(GND) P2.20(GND) P2.30(GND) P2.34(GND) P?#1.2 P?#2.2 P?#3.2
LDO 3V0 0.2A: P2.9(GND) P2.25(GND) P2.39(GND)
NetP2_27: P2.27(ID_SD) ; port ID_SD_27/RTC_I2C_SDA
NetP2_28: P2.28(ID_SC) ; port ID_SC_28/RTC_I2C_SCL

Not connected (* = marked no-connect by the designer): P2 1(3V3) 3(GPIO2) 7(GPIO4) 8(GPIO14) 10(GPIO15) 11(GPIO17) 12(GPIO18) 13(GPIO27) 15(GPIO22) 16(GPIO23) 17(3V3) 18(GPIO24) 19(GPIO10) 21(GPIO9) 22(GPIO25) 23(GPIO11) 24(GPIO8) 26(GPIO7) 29(GPIO5) 31(GPIO6) 32(GPIO12) 33(GPIO13) 35(GPIO19) 36(GPIO16) 37(GPIO26) 38(GPIO20) 40(GPIO21)

### Notes on the sheet
- (near P2) Raspberry Pi Female Connector

### Library data of the parts
P2 = CONN 40POS: GPIO HEADER FOR RASPBERRYPI A+/B; Manufacturer: Adafruit Industries; Manufacturer Part Number: 1992; Supplier 1: Digi-Key; Stock 1: 175; Pricing 1: 1=2.95 (USD); ComponentLink1Description: gpio header raspberry pi; ComponentLink1URL: https://www.digikey.ca/product-detail/en/adafruit-industries-llc/1992/1528-1969-ND/6827092; Supplier Part Number 1: 1528-1969-ND
P?#1 = CONN 2POS ULTRA-FIT 0.138": 2 Positions Header, Shrouded Connector 0.138" (3.50mm) Through Hole Gold; Manufacturer 1: Molex, LLC; Manufacturer Part Number 1: 1722861302; Style: Board to Board or Cable; Shrouding: Shrouded - 4 Wall; Number of Positions: 2; Number of Positions Loaded: All; Contact Length - Post: 0.126" (3.20mm); Material Flammability Rating: UL94 V-0; Mated Stacking Heights: 26.99mm; Voltage: 400V; Supplier 1: Digi-Key; Supplier Part Number 1: WM11673-ND; Packaging: Tray; Part Status: Active; Connector Type: Header; Contact Type: Male Pin; Pitch - Mating: 0.138" (3.50mm); Number of Rows: 1; Row Spacing - Mating: -; Mounting Type: Through Hole; Termination: Kinked Pin, Solder; Fastening Type: Latch Holder; Contact Length - Mating: -; Overall Contact Length: -; Insulation Height: 0.465" (11.80mm); Contact Shape: Square; Contact Finish - Mating: Gold; Contact Finish Thickness - Mating: 30µin (0.76µm); Contact Finish - Post: Tin; Contact Material: Copper Alloy; Insulation Material: Liquid Crystal Polymer (LCP); Operating Temperature: -40°C ~ 120°C; Ingress Protection: -; Insulation Color: Black; Current Rating: -; Contact Finish Thickness - Post: 60µin (1.52µm); ComponentLink1URL: http://www.molex.com/pdm_docs/sd/1722861302_sd.pdf; ComponentLink1Description: http://www.molex.com/pdm_docs/sd/1722861302_sd.pdf
P?#2 P?#3 = CONN 2POS ULTRA-FIT NATURAL COLOR 0.138": 2 Positions Header, Shrouded Connector 0.138" (3.50mm) Through Hole; Manufacturer 1: Molex, LLC; Manufacturer Part Number 1: 1722872102; Style: Board to Cable/Wire; Shrouding: Shrouded - 4 Wall; Number of Positions: 2; Number of Positions Loaded: All; Contact Length - Post: 0.126" (3.20mm); Material Flammability Rating: UL94 V-0; Mated Stacking Heights: 26.99mm; Voltage: 400V; Supplier 1: Digi-Key; Supplier Part Number 1: WM11722-ND; Packaging: Tray; Part Status: Active; Connector Type: Header; Contact Type: Male Pin; Pitch - Mating: 0.138" (3.50mm); Number of Rows: 1; Row Spacing - Mating: -; Mounting Type: Through Hole; Termination: Solder; Fastening Type: Latch Holder; Contact Length - Mating: -; Overall Contact Length: -; Insulation Height: 0.465" (11.80mm); Contact Shape: Square; Contact Finish - Mating: Tin; Contact Finish Thickness - Mating: 60µin (1.52µm); Contact Finish - Post: Tin; Contact Material: Copper Alloy; Insulation Material: Liquid Crystal Polymer (LCP); Operating Temperature: -40°C ~ 105°C; Ingress Protection: -; Insulation Color: Natural; Current Rating: -; Contact Finish Thickness - Post: 60µin (1.52µm); ComponentLink1URL: http://www.molex.com/pdm_docs/sd/1722872102_sd.pdf; ComponentLink1Description: http://www.molex.com/pdm_docs/sd/1722872102_sd.pdf

## Nets that join several sheets
3V0: Voltage Regulator (C?#6.1 U?#2.5 U?#3.5), Ambient Light Sensor (C?#9.1 U3.5 U?#4.5)
3V3: Voltage Regulator (C?#5.1 U?#2.1), RTC (D2.1), Ambient Light Sensor (C?#8.1 U?#4.1), Controller_Board_Interface (6 pins)
+5V: Voltage Regulator (6 pins), Connectors (P2.2 P2.5)
+12V: Voltage Regulator (C?#4.1 R?#1.1 U?#1.3), Controller_Board_Interface (P1.47 P1.48 P1.49 P1.50), Connectors (P?#1.1 P?#2.1 P?#3.1)
GND: Voltage Regulator (10 pins), RTC (6 pins), Ambient Light Sensor (6 pins), Controller_Board_Interface (8 pins), Connectors (8 pins)
PA0/AN0: Ambient Light Sensor (C6.2 R8.1 U3.1), Controller_Board_Interface (P1.25)
PA1/AN1: Voltage Regulator (U?#3.1 U?#3.4), Controller_Board_Interface (P1.24)